# EAGLE design rfid-otp (EAGLE 5.11)
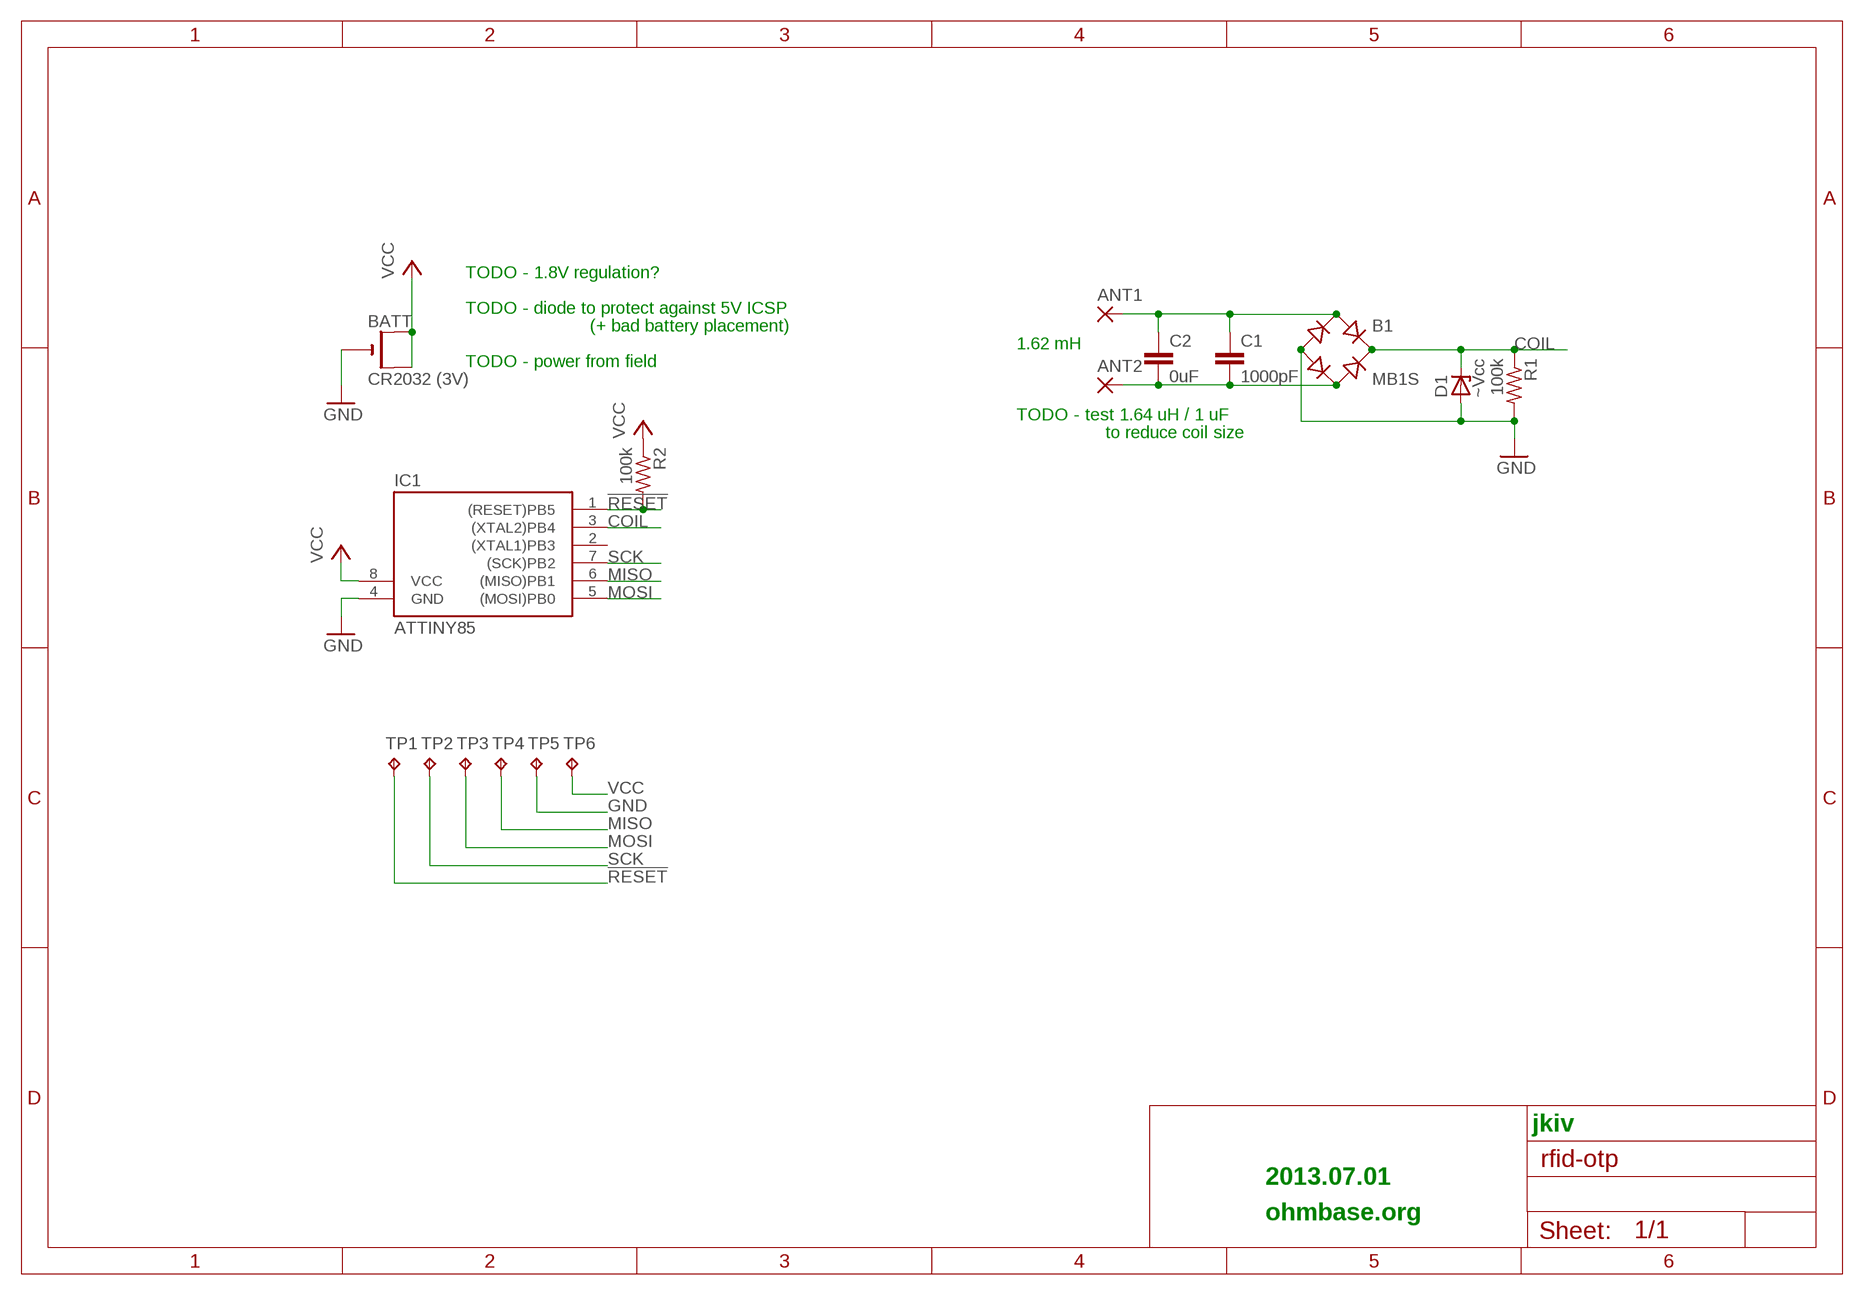
[diagram p0: schematic, sheet 1]

## Parts
ANT1  SMD5  [SMD2,54-5,08]
ANT2  SMD5  [SMD2,54-5,08]
B1  MB1S  [SOIC-4]
BATT  CR2032 (3V)  CR1220SMT  [CR1220-SMD]
C1  1000pF  C-EUC2012  [C2012]
C2  0uF  C-EUC2012  [C2012]
D1  ~Vcc  ZENER-DIODESOT23  [SOT23]
IC1  ATTINY85  TINY12S  [SOIC8]
R1  100k  R-US_R2012  [R2012]
R2  100k  R-US_R2012  [R2012]
TP1  TPTP12SQ  [TP12SQ]
TP2  TPTP12SQ  [TP12SQ]
TP3  TPTP12SQ  [TP12SQ]
TP4  TPTP12SQ  [TP12SQ]
TP5  TPTP12SQ  [TP12SQ]
TP6  TPTP12SQ  [TP12SQ]

## Nets
!RESET: IC1.1((RESET)PB5) R2.2 TP1.TP
ANT1: ANT1.1(P) B1.~1(AC1) C1.1 C2.1
ANT2: ANT2.1(P) B1.~2(AC2) C1.2 C2.2
COIL: B1.+ D1.3(C) IC1.3((XTAL2)PB4) R1.1
GND: B1.- BATT.- D1.1(A) IC1.4(GND) R1.2 TP5.TP
MISO: IC1.6((MISO)PB1) TP4.TP
MOSI: IC1.5((MOSI)PB0) TP3.TP
SCK: IC1.7((SCK)PB2) TP2.TP
VCC: BATT.+$1(+) BATT.+$2(+1) IC1.8(VCC) R2.1 TP6.TP
Unconnected: IC1.2((XTAL1)PB3)

## Notes on the sheet
- TODO - 1.8V regulation?
- TODO - diode to protect against 5V ICSP
- (+ bad battery placement)
- 1.62 mH
- TODO - power from field
- TODO - test 1.64 uH / 1 uF
- to reduce coil size
- jkiv
- 2013.07.01
- ohmbase.org

## Library data of the parts
ANT1 ANT2 = wirepad:SMD5: SMD PAD
B1 = rectifier:MB*S: Bridge Rectifier Source: http://www.fairchildsemi.com/ds/MB/MB6S.pdf
BATT = adafruit:CR1220: CR1216/CR1220/CR1225 12mm 3V lithium coin cell Great for battery packup. Both SMT and THM holders. Note the THM package has the ground pads on both sides of the PCB so that the masks are the same - this reduces the cost
C1 C2 = rcl:C-EU: CAPACITOR, European symbol
D1 = diode:ZENER-DIODE: Z-Diode
IC1 = atmel:TINY12*: MICROCONTROLLER 1 Kbytes FLASH 64 bytes EEPROM; OC_FARNELL: unknown; OC_NEWARK: unknown
R1 R2 = rcl:R-US_: RESISTOR, American symbol
TP1-TP6 = testpad:TP: Test pad

## Board
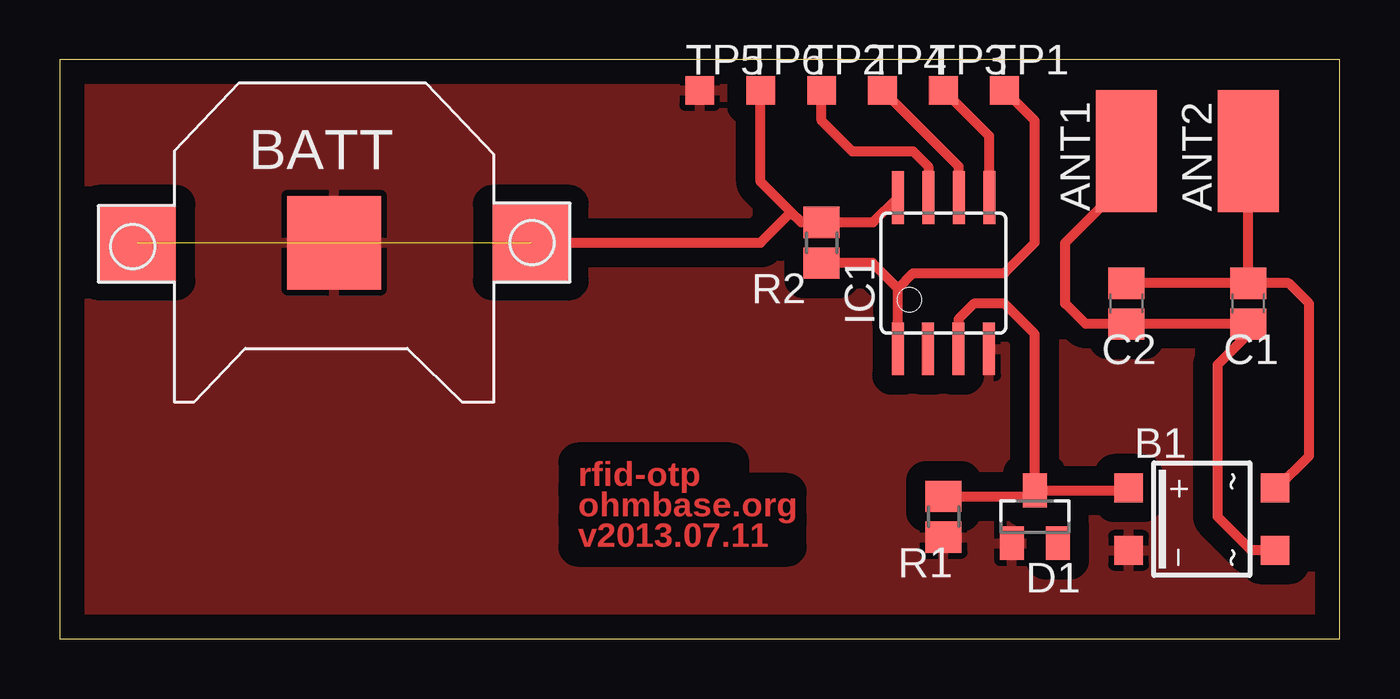
[diagram p1: board, top side]

Size 53.34 x 24.13 mm. Coordinates in mm from the lower left corner, seen from the top.
Outline: 0,0 53.34,0 53.34,24.13 0,24.13 0,0
Copper layers (1*16): Top 0.035mm / dielectric 1.5mm / Bottom 0.035mm
Design rules "default": minimum track width 10mil, minimum drill 24mil, track to track 8mil, track to pad 8mil, pad to pad 8mil, via to via 8mil, smd to smd 8mil, copper to edge 40mil, drill to drill 8mil, minimum pad ring 10mil, minimum via ring 8mil, stop-mask expansion 4mil, vias tented up to drill 0mil, thermal gap 10mil

### Footprints (pad centres in the part's own frame; a part is rotated, then mirrored left to right if it is on the bottom)
SMD2,54-5,08 = smd 2.54 x 5.08: 1 0,0
SOIC-4 = smd 1.2 x 1.2: + 1.3,3.05; - -1.3,3.05; ~1 -1.3,-3.05; ~2 1.3,-3.05
CR1220-SMD = smd 3.2 x 3.2: +$1 -8.2,0; +$2 8.2,0 | smd 3.9 x 3.9: - 0,0
C2012 = smd 1.3 x 1.5: 1 -0.85,0; 2 0.85,0
SOT23 = smd 1 x 1.4: 1 -0.95,-1.1; 2 0.95,-1.1; 3 0,1.1
SOIC8 = smd 0.5 x 2.2: 1 -1.905,-3.154; 2 -0.645,-3.154; 3 0.625,-3.154; 4 1.895,-3.154; 5 1.905,3.154; 6 0.635,3.154; 7 -0.635,3.154; 8 -1.905,3.154
R2012 = smd 1.3 x 1.5: 1 -0.85,0; 2 0.85,0
TP12SQ = smd 1.2 x 1.2: TP 0,0

### Placement (x,y rotation side)
ANT1  44.45,20.32 0 top
ANT2  49.53,20.32 0 top
B1  47.6,4.98 90 top
BATT  11.43,16.51 180 top
C1  49.53,13.97 90 top
C2  44.45,13.97 90 top
D1  40.64,5.08 0 top
IC1  36.83,15.24 0 top
R1  36.83,5.08 270 top
R2  31.75,16.51 270 top
TP1  39.37,22.86 0 top
TP2  31.75,22.86 0 top
TP3  36.83,22.86 0 top
TP4  34.29,22.86 0 top
TP5  26.67,22.86 0 top
TP6  29.21,22.86 0 top

### Tracks (layer width: path | path; a pad name or v marks a point on that pad's centre or on a via)
!RESET
  Top 0.406: R2.2 33.87,15.66 34.92,14.61 | IC1.1 34.92,14.61 | TP1.TP 40.64,21.59 40.64,16.51 39.37,15.24 35.56,15.24 34.92,14.61
ANT1
  Top 0.406: ANT1.1 44.45,19.05 41.91,16.51 41.91,13.97 42.76,13.12 C2.1 C1.1 49.53,12.7 48.26,11.43 48.26,5.08 49.66,3.68 B1.~1
ANT2
  Top 0.406: B1.~2 50.73,6.28 52.07,7.62 52.07,13.97 51.22,14.82 C1.2 | C1.2 C2.2 | C1.2 ANT2.1
COIL
  Top 0.406: R1.1 40.39,5.93 D1.3 | D1.3 44.45,6.18 B1.+ | IC1.3 37.45,13.32 38.1,13.97 39.37,13.97 40.64,12.7 D1.3
GND
  pour Top (isolate 0.813): 0,24.13 53.34,24.13 53.34,0 0,0
MISO
  Top 0.406: IC1.6 37.47,19.68 TP4.TP
MOSI
  Top 0.406: IC1.5 38.73,20.95 TP3.TP
SCK
  Top 0.406: IC1.7 36.2,19.68 35.56,20.32 33.02,20.32 31.75,21.59 TP2.TP
VCC  (1 unrouted)
  Top 0.406: IC1.8 33.89,17.36 R2.1 30.9,17.36 30.48,17.78 | 30.48,17.78 29.21,19.05 TP6.TP | BATT.+$1 29.21,16.51 30.48,17.78

### Text on the board
Top: rfid-otp | ohmbase.org | v2013.07.11